# Altium schematic sheet CPU_HDMI_PHY.SchDoc
size A3; SheetNumber: 10; SheetTotal: 21
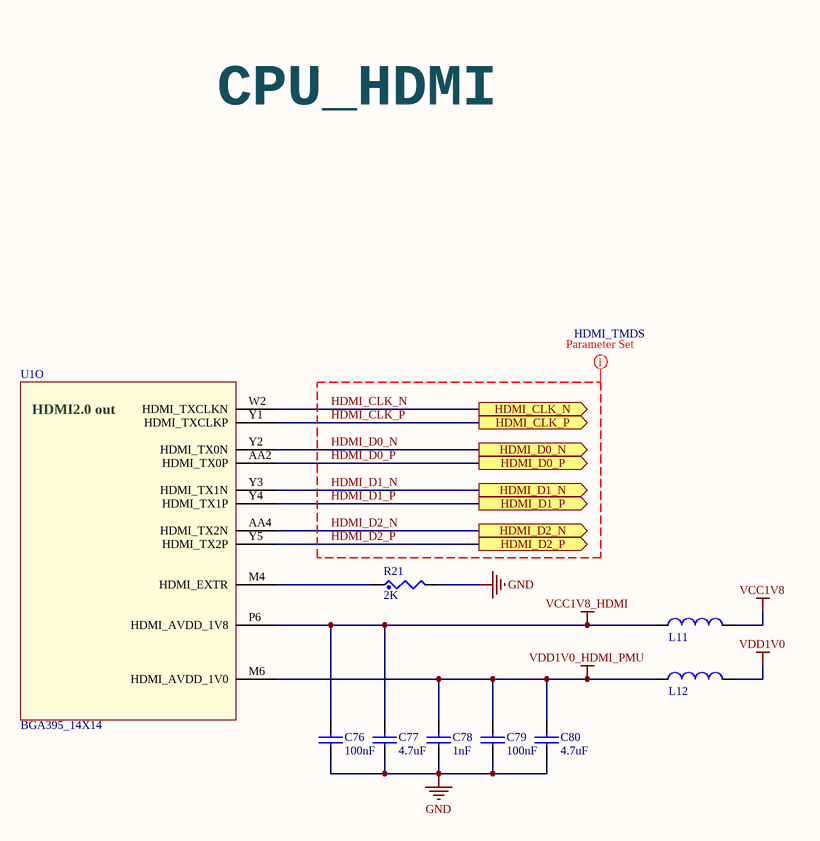
[diagram p0: CPU_HDMI_PHY.SchDoc]

## Parts
C76  100nF  [0402_CC - C]
C77  4.7uF  [0402_CC - C]
C78  1nF  [0402_CC - C]
C79  100nF  [0402_CC - C]
C80  4.7uF  [0402_CC - C]
L11  INDCHIP  [0603_C_Inductor]  (value not drawn)
L12  INDCHIP  [0603_C_Inductor]  (value not drawn)
R21  2K  [0402_CR]
U1  BGA395_14X14  [BGA395C65P21X21_1750X1750X117]  (part O of 17)

## Ports
HDMI_CLK_N (out), HDMI_CLK_P (out), HDMI_D0_N (out), HDMI_D0_P (out), HDMI_D1_N (out), HDMI_D1_P (out), HDMI_D2_N (out), HDMI_D2_P (out)

## Nets
GND: C76.2 C77.2 C78.2 C79.2 C80.2 R21.2
VCC1V8: L11.2
VCC1V8_HDMI: C76.1 C77.1 L11.1 U1.P6(HDMI_AVDD_1V8)
VDD1V0: L12.2
VDD1V0_HDMI_PMU: C78.1 C79.1 C80.1 L12.1 U1.M6(HDMI_AVDD_1V0)
HDMI_CLK_N: U1.W2(HDMI_TXCLKN) ; port HDMI_CLK_N
HDMI_CLK_P: U1.Y1(HDMI_TXCLKP) ; port HDMI_CLK_P
HDMI_D0_N: U1.Y2(HDMI_TX0N) ; port HDMI_D0_N
HDMI_D0_P: U1.AA2(HDMI_TX0P) ; port HDMI_D0_P
HDMI_D1_N: U1.Y3(HDMI_TX1N) ; port HDMI_D1_N
HDMI_D1_P: U1.Y4(HDMI_TX1P) ; port HDMI_D1_P
HDMI_D2_N: U1.AA4(HDMI_TX2N) ; port HDMI_D2_N
HDMI_D2_P: U1.Y5(HDMI_TX2P) ; port HDMI_D2_P
NetR21_1: R21.1 U1.M4(HDMI_EXTR)

## Layout directives
net class HDMI_TMDS: HDMI_CLK_N, HDMI_CLK_P, HDMI_D0_N, HDMI_D0_P, HDMI_D1_N, HDMI_D1_P, HDMI_D2_N, HDMI_D2_P

## Notes on the sheet
- CPU_HDMI
- (in symbol RK3328, part O) HDMI2.0 out

## Library data of the parts
C76-C80 = CAP_NP: CLASS: DISCRETE
L11 L12 = INDCHIP: Fixed Inductors  TDK, By AAR
R21 = RES: CLASS: DISCRETE
U1 = RK3328: By AAR